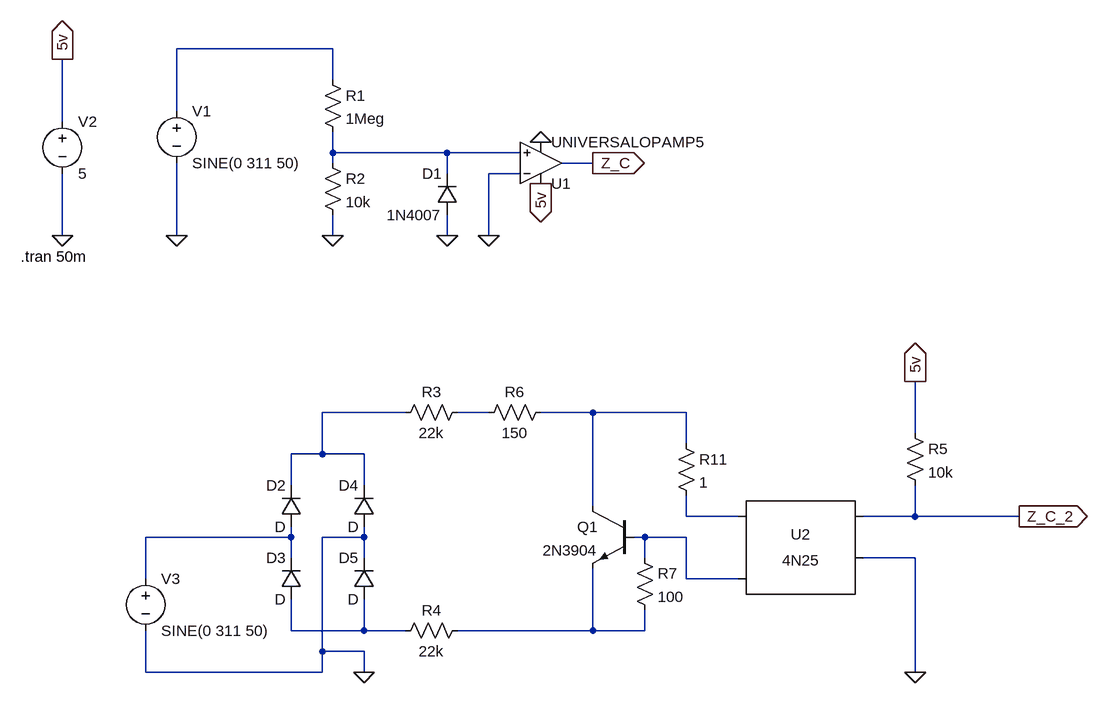
[diagram p0: schematic Zero_Cross.asc]
Zero_Cross.asc, the LTspice schematic file:
Version 4.1
SHEET 1 4244 1764
WIRE 272 32 32 32
WIRE 272 80 272 32
WIRE 32 128 32 32
WIRE -144 144 -144 48
WIRE 272 192 272 160
WIRE 448 192 272 192
WIRE 560 192 448 192
WIRE 272 208 272 192
WIRE 672 208 624 208
WIRE 448 224 448 192
WIRE 560 224 512 224
WIRE -144 320 -144 224
WIRE 32 320 32 208
WIRE 272 320 272 288
WIRE 448 320 448 288
WIRE 512 320 512 224
WIRE 384 592 256 592
WIRE 512 592 464 592
WIRE 672 592 592 592
WIRE 816 592 672 592
WIRE 1168 624 1168 544
WIRE 816 640 816 592
WIRE 256 656 256 592
WIRE 256 656 208 656
WIRE 320 656 256 656
WIRE 208 704 208 656
WIRE 320 704 320 656
WIRE 672 736 672 592
WIRE 816 752 816 720
WIRE 896 752 816 752
WIRE 1168 752 1168 704
WIRE 1168 752 1088 752
WIRE 1328 752 1168 752
WIRE 208 784 208 768
WIRE 208 784 -16 784
WIRE 320 784 320 768
WIRE 320 784 256 784
WIRE 752 784 736 784
WIRE 816 784 752 784
WIRE 208 816 208 784
WIRE 320 816 320 784
WIRE 752 816 752 784
WIRE 1168 816 1088 816
WIRE -16 848 -16 784
WIRE 816 848 816 784
WIRE 896 848 816 848
WIRE 208 928 208 880
WIRE 320 928 320 880
WIRE 320 928 208 928
WIRE 384 928 320 928
WIRE 672 928 672 832
WIRE 672 928 464 928
WIRE 752 928 752 896
WIRE 752 928 672 928
WIRE 256 960 256 784
WIRE 320 960 256 960
WIRE -16 992 -16 928
WIRE 256 992 256 960
WIRE 256 992 -16 992
WIRE 320 992 320 960
WIRE 1168 992 1168 816
FLAG 32 320 0
FLAG 272 320 0
FLAG 448 320 0
FLAG 512 320 0
FLAG 592 176 0
FLAG -144 320 0
FLAG -144 48 5v
IOPIN -144 48 Out
FLAG 1168 544 5v
IOPIN 1168 544 Out
FLAG 320 992 0
FLAG 1168 992 0
FLAG 592 240 5v
IOPIN 592 240 Out
FLAG 672 208 Z_C
IOPIN 672 208 Out
FLAG 1328 752 Z_C_2
IOPIN 1328 752 Out
SYMBOL voltage 32 112 R0
WINDOW 123 0 0 Left 0
WINDOW 39 0 0 Left 0
SYMATTR InstName V1
SYMATTR Value SINE(0 311 50)
SYMBOL res 256 64 R0
SYMATTR InstName R1
SYMATTR Value 1Meg
SYMBOL res 256 192 R0
SYMATTR InstName R2
SYMATTR Value 10k
SYMBOL diode 464 288 R180
WINDOW 0 24 64 Left 2
WINDOW 3 24 0 Left 2
SYMATTR InstName D1
SYMATTR Value 1N4007
SYMBOL voltage -144 128 R0
WINDOW 123 0 0 Left 0
WINDOW 39 0 0 Left 0
SYMATTR InstName V2
SYMATTR Value 5
SYMBOL OpAmps\\UniversalOpAmp5 592 208 M180
SYMATTR InstName U1
SYMBOL voltage -16 832 R0
WINDOW 123 0 0 Left 0
WINDOW 39 0 0 Left 0
SYMATTR InstName V3
SYMATTR Value SINE(0 311 50)
SYMBOL diode 224 768 R180
WINDOW 0 24 64 Left 2
WINDOW 3 24 0 Left 2
SYMATTR InstName D2
SYMBOL diode 224 880 R180
WINDOW 0 24 64 Left 2
WINDOW 3 24 0 Left 2
SYMATTR InstName D3
SYMBOL diode 336 768 R180
WINDOW 0 24 64 Left 2
WINDOW 3 24 0 Left 2
SYMATTR InstName D4
SYMBOL diode 336 880 R180
WINDOW 0 24 64 Left 2
WINDOW 3 24 0 Left 2
SYMATTR InstName D5
SYMBOL Optos\\4N25 992 816 R0
SYMATTR InstName U2
SYMBOL res 480 576 R90
WINDOW 0 0 56 VBottom 2
WINDOW 3 32 56 VTop 2
SYMATTR InstName R3
SYMATTR Value 22k
SYMBOL res 480 912 R90
WINDOW 0 0 56 VBottom 2
WINDOW 3 32 56 VTop 2
SYMATTR InstName R4
SYMATTR Value 22k
SYMBOL res 1152 608 R0
SYMATTR InstName R5
SYMATTR Value 10k
SYMBOL npn 736 736 M0
SYMATTR InstName Q1
SYMATTR Value 2N3904
SYMBOL res 608 576 R90
WINDOW 0 0 56 VBottom 2
WINDOW 3 32 56 VTop 2
SYMATTR InstName R6
SYMATTR Value 150
SYMBOL res 736 800 R0
SYMATTR InstName R7
SYMATTR Value 100
SYMBOL res 800 624 R0
SYMATTR InstName R11
SYMATTR Value 1
TEXT -208 352 Left 2 !.tran 50m

The netlist it stands for:
* Zero_Cross.asc
V1 N001 0 SINE(0 311 50)
R1 N001 N002 1Meg
R2 N002 0 10k
D1 0 N002 1N4007
V2 5v 0 5
X§U1 N002 0 5v 0 Z_C level5 Avol=1Meg GBW=10Meg Phimargin=45 SlewPos=10Meg SlewNeg=10Meg En=0 Enk=0 In=0 Ink=0 Rcm=500Meg Ccm=1p Rdiff=500k Cdiff=2p Ro=1k Vos=0 Ibp=2n Ibn=1n Iq=1m Rail=0 Ilimit=25m  ; UNIVERSALOPAMP5, pins In+ In- V+ V- OUT
V3 N007 0 SINE(0 311 50)
D2 N007 N003 D
D3 N009 N007 D
D4 0 N003 D
D5 N009 0 D
X§U2 N006 N008 Z_C_2 0 NC_01 4N25
R3 N004 N003 22k
R4 N010 N009 22k
R5 5v Z_C_2 10k
Q1 N005 N008 N010 0 2N3904
R6 N005 N004 150
R7 N008 N010 100
R11 N005 N006 1
.model D D
.lib standard.dio
.model NPN NPN
.model PNP PNP
.lib standard.bjt
.tran 50m
.lib 4N25.sub
.backanno
.end